# EAGLE design DESIGN7WM (EAGLE 9.6.1)
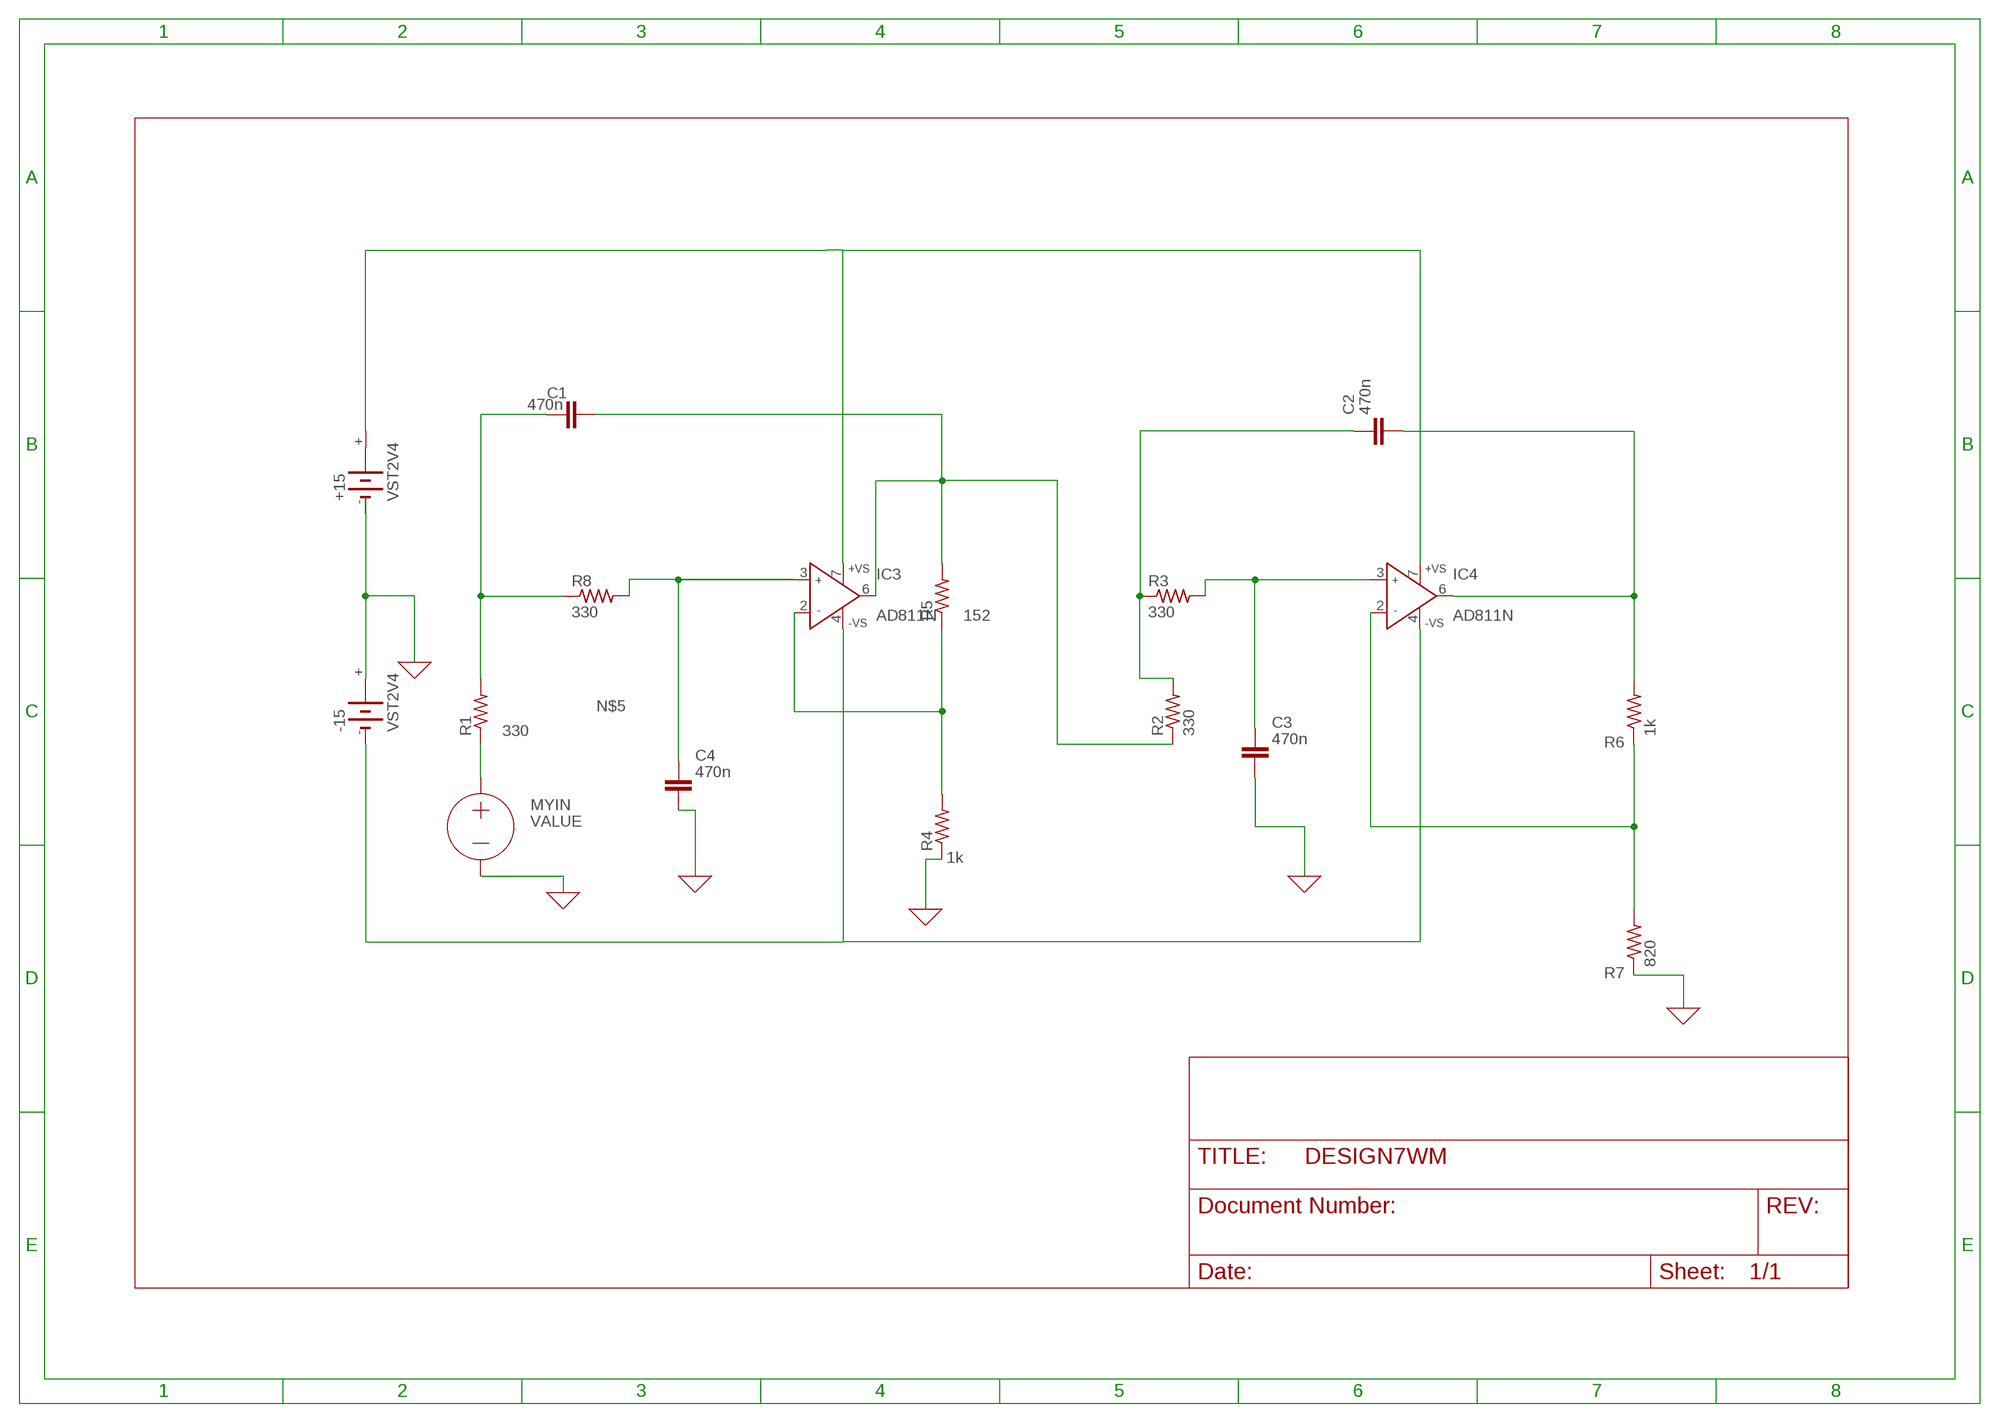
[diagram p0: schematic, sheet 1]

## Parts
+15  VST2V4  [VST2]
-15  VST2V4  [VST2]
C1  470n  C  (no package)
C2  470n  C  (no package)
C3  470n  C  (no package)
C4  470n  C  (no package)
IC3  AD811N  [DIL08]
IC4  AD811N  [DIL08]
MYIN  0V  VOLTAGE  (no package)
R1  330  R-US_VTA52  [VTA52]
R2  330  R-US_VTA52  [VTA52]
R3  330  R-US_VTA52  [VTA52]
R4  1k  R-US_VTA52  [VTA52]
R5  152  R-US_VTA52  [VTA52]
R6  1k  R-US_VTA52  [VTA52]
R7  820  R-US_VTA52  [VTA52]
R8  330  R-US_VTA52  [VTA52]

## Nets
0: +15.- -15.+ -15.+@1(+) C3.2 C4.2 MYIN.- R4.1 R7.1 ; supply symbol labelled GND
N$1: C4.1 IC3.3(IN+) R8.2
N$2: -15.- IC3.4(-VS) IC4.4(-VS)
N$3: +15.+ IC3.7(+VS) IC4.7(+VS)
N$4: C1.1 R1.2 R8.1
N$5: MYIN.+ R1.1
N$6: C3.1 IC4.3(IN+) R3.2
N$7: IC4.2(IN-) R6.1 R7.2
N$8: IC3.2(IN-) R4.2 R5.1
N$9: C1.2 IC3.6(OUT) R2.1 R5.2
N$11: C2.2 IC4.6(OUT) R6.2
N$12: C2.1 R2.2 R3.1
Unconnected: +15.+@1(+)

## Library data of the parts
+15 -15 = battery:VST2V4: NC ACCU Varta Safe Tronic 2V4; OC_NEWARK: unknown
C1-C4 = ngspice-simulation:C: CAPACITOR
IC3 IC4 = analog-devices:AD811: High Performance Video Op Amp Source: http://www.analog.com/static/imported-files/data_sheets/AD811.pdf; MF: ALTERA CORPORATION; MPN: AD811AN; OC_FARNELL: 1464857; OC_NEWARK: unknown
MYIN = ngspice-simulation:VOLTAGE: Independent Voltage Source, either DC, AC, PULSE, SINE, PWL, EXP, or SFFM
R1-R8 = rcl:R-US_: RESISTOR, American symbol; OC_NEWARK: unknown; SPICEPREFIX: R

## Board
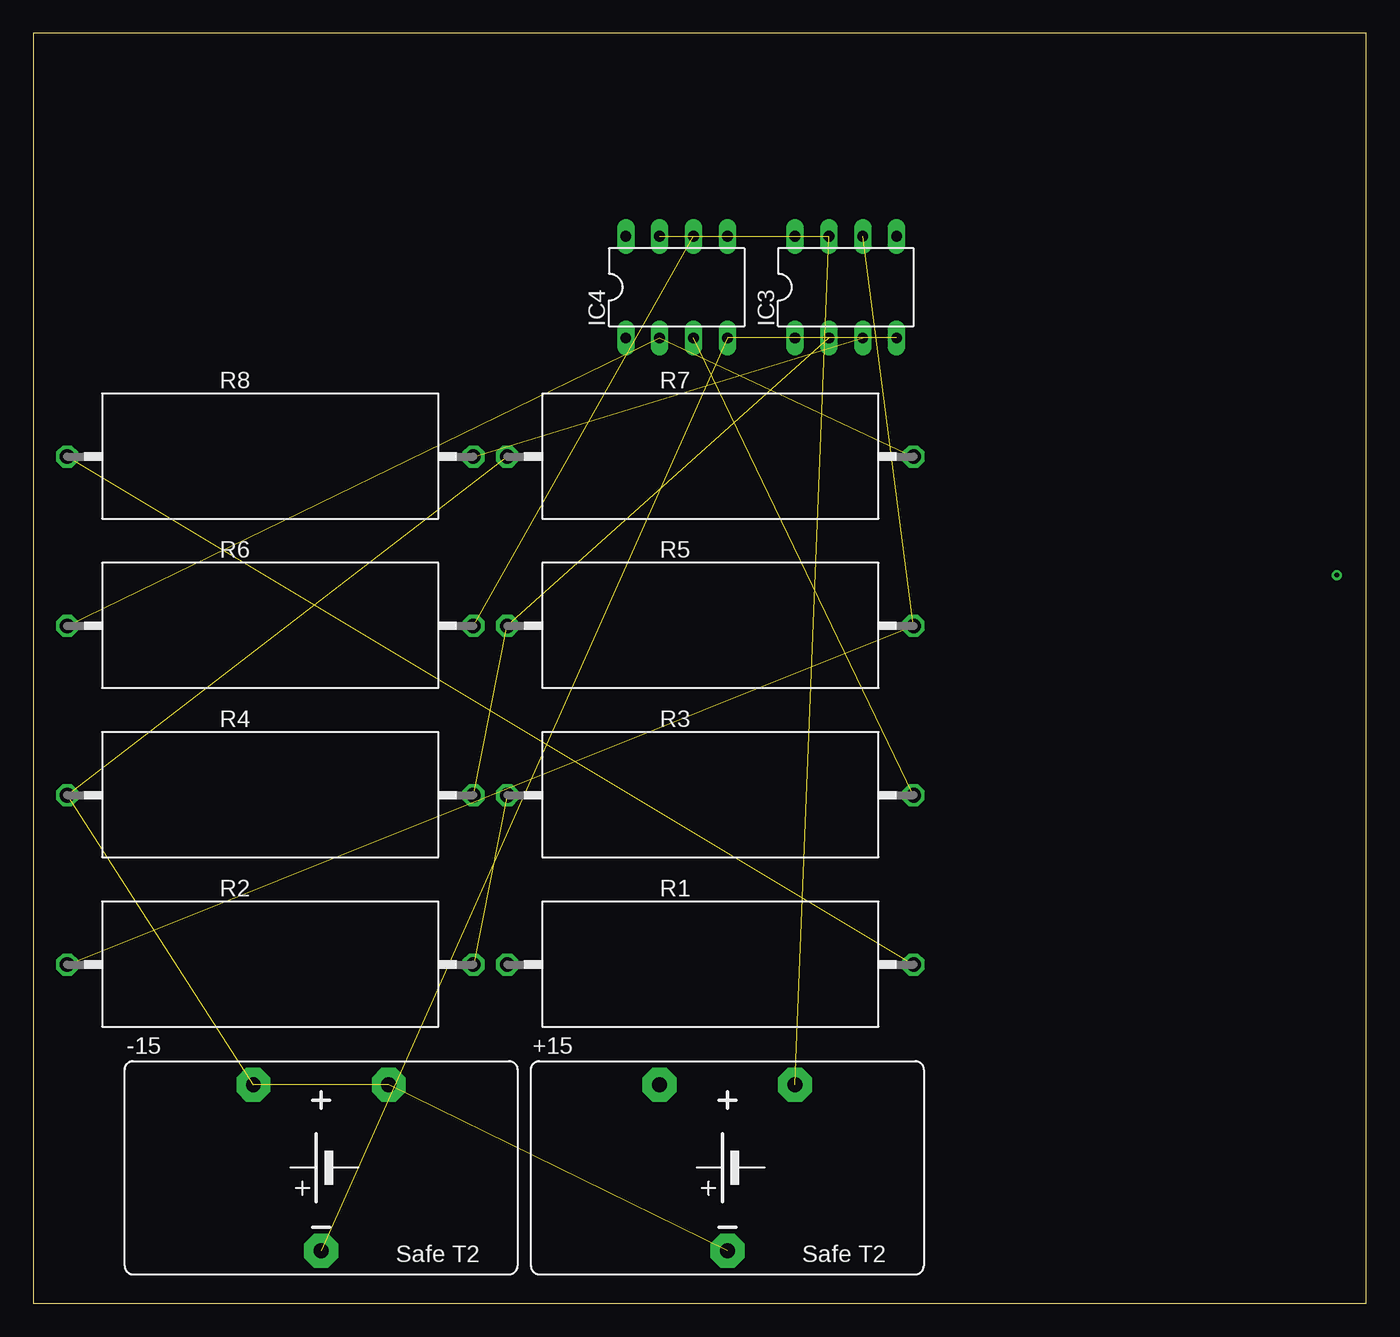
[diagram p1: board, top side]

Size 100 x 95.24 mm. Coordinates in mm from the lower left corner, seen from the top.
Outline: 0,0 100,0 100,95.24 0,95.24 0,0
Copper layers (1*16): Top 0.035mm / dielectric 1.5mm / Bottom 0.035mm
Design rules "default *": minimum track width 6mil, minimum drill 12mil, track to track 6mil, track to pad 6mil, pad to pad 6mil, via to via 6mil, smd to smd 6mil, copper to edge 40mil, drill to drill 6mil, minimum pad ring 10mil, minimum via ring 8mil, stop-mask expansion 2mil, vias tented up to drill 0mil, thermal gap 10mil

### Footprints (pad centres in the part's own frame; a part is rotated, then mirrored left to right if it is on the bottom)
VST2 = drill 1.118 pad 2.54 octagon: + 5.08,6.223; +@1 -5.08,6.223; - 0,-6.223
DIL08 = drill 0.813 long: 1 -3.81,-3.81; 2 -1.27,-3.81; 3 1.27,-3.81; 4 3.81,-3.81; 5 3.81,3.81; 6 1.27,3.81; 7 -1.27,3.81; 8 -3.81,3.81
VTA52 = drill 1.1 octagon: 1 -15.24,0; 2 15.24,0

### Placement (x,y rotation side)
+15  52.07,10.16 0 top
-15  21.59,10.16 0 top
IC3  60.96,76.2 0 top
IC4  48.26,76.2 0 top
R1  50.8,25.4 0 top
R2  17.78,25.4 0 top
R3  50.8,38.1 0 top
R4  17.78,38.1 0 top
R5  50.8,50.8 0 top
R6  17.78,50.8 0 top
R7  50.8,63.5 0 top
R8  17.78,63.5 0 top

### Tracks (layer width: path | path; a pad name or v marks a point on that pad's centre or on a via)
0  (4 unrouted)
N$1  (1 unrouted)
N$2  (2 unrouted)
N$3  (2 unrouted)
N$4  (1 unrouted)
N$6  (1 unrouted)
N$7  (2 unrouted)
N$8  (2 unrouted)
N$9  (2 unrouted)
N$10  (via drill 0.35)
  other vias: 97.79,54.61
N$11  (1 unrouted)
N$12  (1 unrouted)